# EAGLE design DigitalIn-01b (EAGLE 6.2)
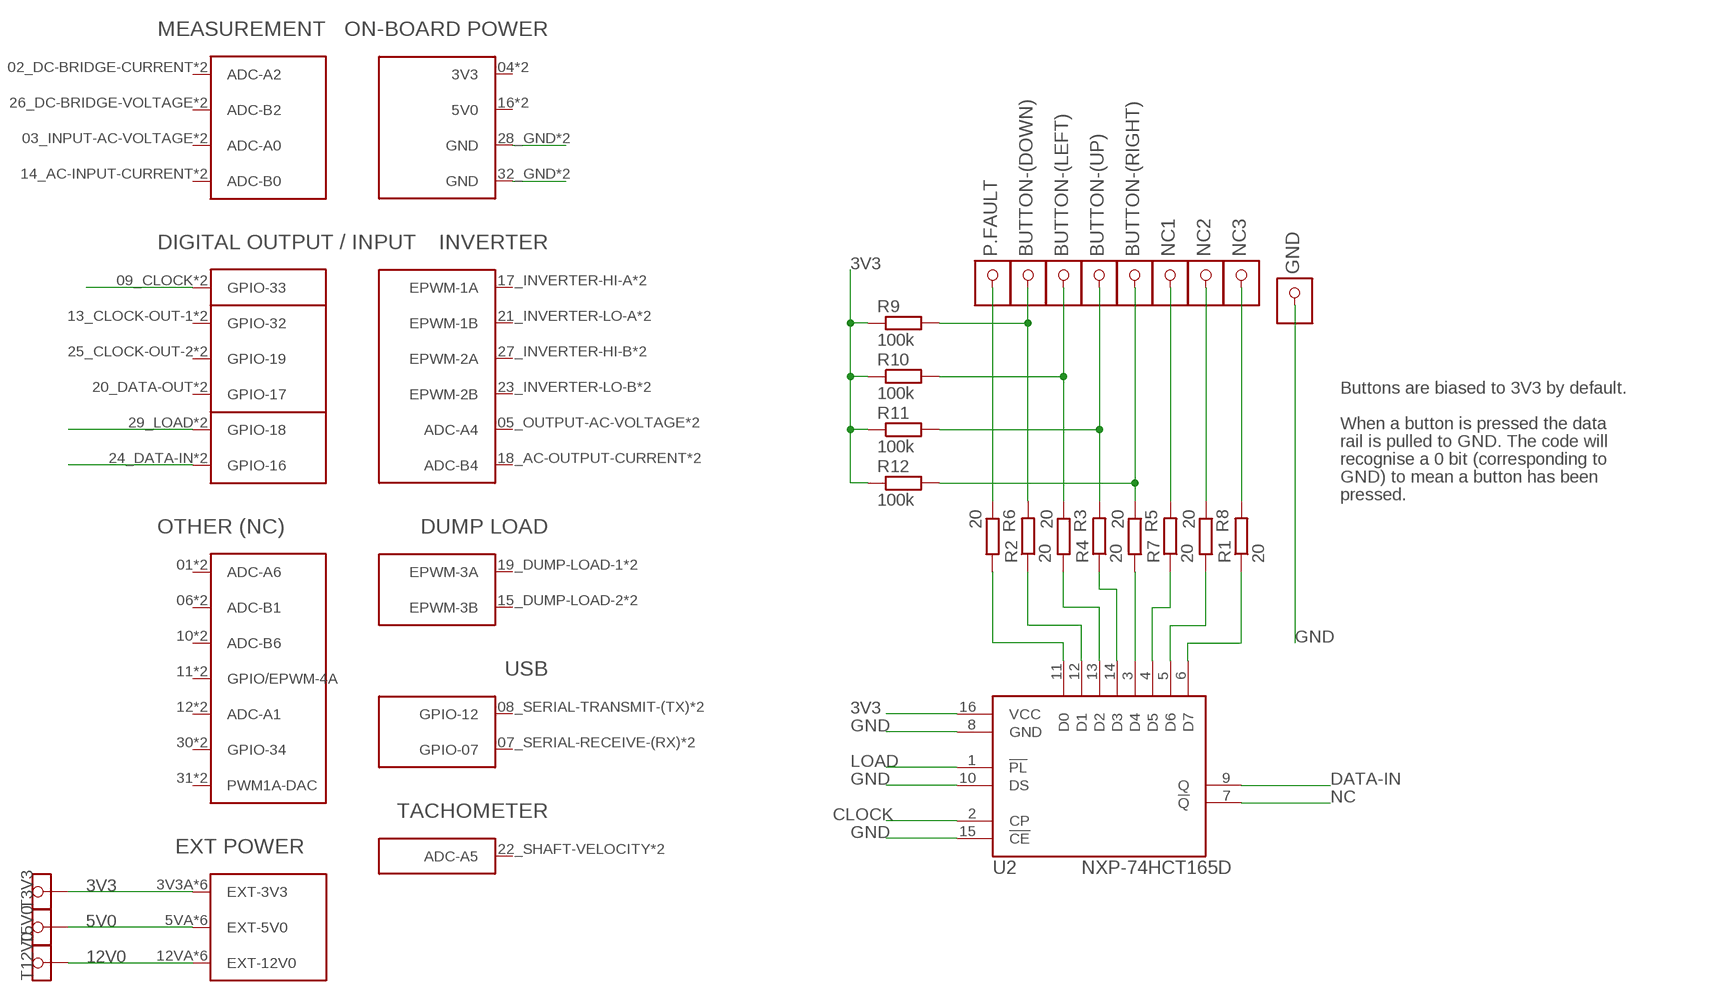
[diagram p0: schematic, sheet 1]

## Parts
BUTTON-(DOWN)  1X1HEADER(W/VIA)  [1X1HEADER(W/VIA)]
BUTTON-(LEFT)  1X1HEADER(W/VIA)  [1X1HEADER(W/VIA)]
BUTTON-(RIGHT)  1X1HEADER(W/VIA)  [1X1HEADER(W/VIA)]
BUTTON-(UP)  1X1HEADER(W/VIA)  [1X1HEADER(W/VIA)]
GND  1X1HEADER(W/VIA)  [1X1HEADER(W/VIA)]
NC1  1X1HEADER(W/VIA)  [1X1HEADER(W/VIA)]
NC2  1X1HEADER(W/VIA)  [1X1HEADER(W/VIA)]
NC3  1X1HEADER(W/VIA)  [1X1HEADER(W/VIA)]
P.FAULT  1X1HEADER(W/VIA)  [1X1HEADER(W/VIA)]
R1  20  R-EU_R0805  [R0805]
R2  20  R-EU_R0805  [R0805]
R3  20  R-EU_R0805  [R0805]
R4  20  R-EU_R0805  [R0805]
R5  20  R-EU_R0805  [R0805]
R6  20  R-EU_R0805  [R0805]
R7  20  R-EU_R0805  [R0805]
R8  20  R-EU_R0805  [R0805]
R9  100k  R-EU_R0805  [R0805]
R10  100k  R-EU_R0805  [R0805]
R11  100k  R-EU_R0805  [R0805]
R12  100k  R-EU_R0805  [R0805]
T3V3  TESTPAD  [TESTPAD]
T5V0  TESTPAD  [TESTPAD]
T12V0  TESTPAD  [TESTPAD]
U1  CONTROLLER_STACK  [CONTROLLER_STACK]
U2  NXP-74HCT165D  [SOIC-16D]

## Nets
3V3: R9.1 R10.1 R11.1 R12.1 T3V3.TP U1.3V3A(EXT-3V3) U1.3V3B(EXT-3V3) U1.3V3C(EXT-3V3) U1.3V3D(EXT-3V3) U1.3V3E(EXT-3V3) U1.3V3F(EXT-3V3) U2.16(VCC)
5V0: T5V0.TP U1.5VA(EXT-5V0) U1.5VB(EXT-5V0) U1.5VC(EXT-5V0) U1.5VD(EXT-5V0) U1.5VE(EXT-5V0) U1.5VF(EXT-5V0)
12V0: T12V0.TP U1.12VA(EXT-12V0) U1.12VB(EXT-12V0) U1.12VC(EXT-12V0) U1.12VD(EXT-12V0) U1.12VE(EXT-12V0) U1.12VF(EXT-12V0)
CLOCK: U1.09_CLOCK(GPIO-33) U1.C9(GPIO-33) U2.2(CP)
DATA-IN: U1.24_DATA-IN(GPIO-16) U1.C24(GPIO-16) U2.9(Q)
GND: GND.P$2 GND.P$3 GND.P$4 GND.PAD U1.28_GND(GND) U1.32_GND(GND) U1.C28(GND) U1.C32(GND) U2.8(GND) U2.10(DS) U2.15(!CE)
LOAD: U1.29_LOAD(GPIO-18) U1.C29(GPIO-18) U2.1(!PL)
N$1: R6.2 U2.11(D0)
N$2: R2.1 U2.12(D1)
N$3: R3.2 U2.13(D2)
N$4: R4.1 U2.14(D3)
N$5: P.FAULT.P$2 P.FAULT.P$3 P.FAULT.P$4 P.FAULT.PAD R6.1
N$6: R7.1 U2.4(D5)
N$7: R8.2 U2.5(D6)
N$8: U2.7(!Q)
N$9: R1.1 U2.6(D7)
N$10: R5.2 U2.3(D4)
N$11: BUTTON-(DOWN).P$2 BUTTON-(DOWN).P$3 BUTTON-(DOWN).P$4 BUTTON-(DOWN).PAD R2.2 R9.2
N$12: BUTTON-(LEFT).P$2 BUTTON-(LEFT).P$3 BUTTON-(LEFT).P$4 BUTTON-(LEFT).PAD R3.1 R10.2
N$13: BUTTON-(UP).P$2 BUTTON-(UP).P$3 BUTTON-(UP).P$4 BUTTON-(UP).PAD R4.2 R11.2
N$14: BUTTON-(RIGHT).P$2 BUTTON-(RIGHT).P$3 BUTTON-(RIGHT).P$4 BUTTON-(RIGHT).PAD R5.1 R12.2
N$15: NC1.P$2 NC1.P$3 NC1.P$4 NC1.PAD R7.2
N$16: NC2.P$2 NC2.P$3 NC2.P$4 NC2.PAD R8.1
N$17: NC3.P$2 NC3.P$3 NC3.P$4 NC3.PAD R1.2
Unconnected: U1.01(ADC-A6) U1.02_DC-BRIDGE-CURRENT(ADC-A2) U1.03_INPUT-AC-VOLTAGE(ADC-A0) U1.04(3V3) U1.05_OUTPUT-AC-VOLTAGE(ADC-A4) U1.06(ADC-B1) U1.07_SERIAL-RECEIVE-(RX)(GPIO-07) U1.08_SERIAL-TRANSMIT-(TX)(GPIO-12) U1.10(ADC-B6) U1.11(GPIO/EPWM-4A) U1.12(ADC-A1) U1.13_CLOCK-OUT-1(GPIO-32) U1.14_AC-INPUT-CURRENT(ADC-B0) U1.15_DUMP-LOAD-2(EPWM-3B) U1.16(5V0) U1.17_INVERTER-HI-A(EPWM-1A) U1.18_AC-OUTPUT-CURRENT(ADC-B4) U1.19_DUMP-LOAD-1(EPWM-3A) U1.20_DATA-OUT(GPIO-17) U1.21_INVERTER-LO-A(EPWM-1B) U1.22_SHAFT-VELOCITY(ADC-A5) U1.23_INVERTER-LO-B(EPWM-2B) U1.25_CLOCK-OUT-2(GPIO-19) U1.26_DC-BRIDGE-VOLTAGE(ADC-B2) U1.27_INVERTER-HI-B(EPWM-2A) U1.30(GPIO-34) U1.31(PWM1A-DAC) U1.C1(ADC-A6) U1.C2(ADC-A2) U1.C3(ADC-A0) U1.C4(3V3) U1.C5(ADC-A4) U1.C6(ADC-B1) U1.C7(GPIO-07) U1.C8(GPIO-12) U1.C10(ADC-B6) U1.C11(GPIO/EPWM-4A) U1.C12(ADC-A1) U1.C13(GPIO-32) U1.C14(ADC-B0) U1.C15(EPWM-3B) U1.C16(5V0) U1.C17(EPWM-1A) U1.C18(ADC-B4) U1.C19(EPWM-3A) U1.C20(GPIO-17) U1.C21(EPWM-1B) U1.C22(ADC-A5) U1.C23(EPWM-2B) U1.C25(GPIO-19) U1.C26(ADC-B2) U1.C27(EPWM-2A) U1.C30(GPIO-34) U1.C31(PWM1A-DAC)

## Notes on the sheet
- Buttons are biased to 3V3 by default.
- When a button is pressed the data
- rail is pulled to GND. The code will
- recognise a 0 bit (corresponding to
- GND) to mean a button has been
- pressed.
- NC

## Library data of the parts
BUTTON-(DOWN) BUTTON-(LEFT) BUTTON-(RIGHT) BUTTON-(UP) GND NC1-NC3 P.FAULT = headers v6-2:1X1HEADER(W/VIA)
R1-R12 = rcl:R-EU_: RESISTOR, European symbol
T3V3 T5V0 T12V0 = PCB_ControlStack:TESTPAD
U1 = PCB_ControlStack:CONTROLLER_STACK
U2 = PCB_ControlStack:NXP-74HCT165D: NXP 74HCT165D Parallel-to-Serial Shift Register, 8 bit, Parallel load or Serial shift

## Board
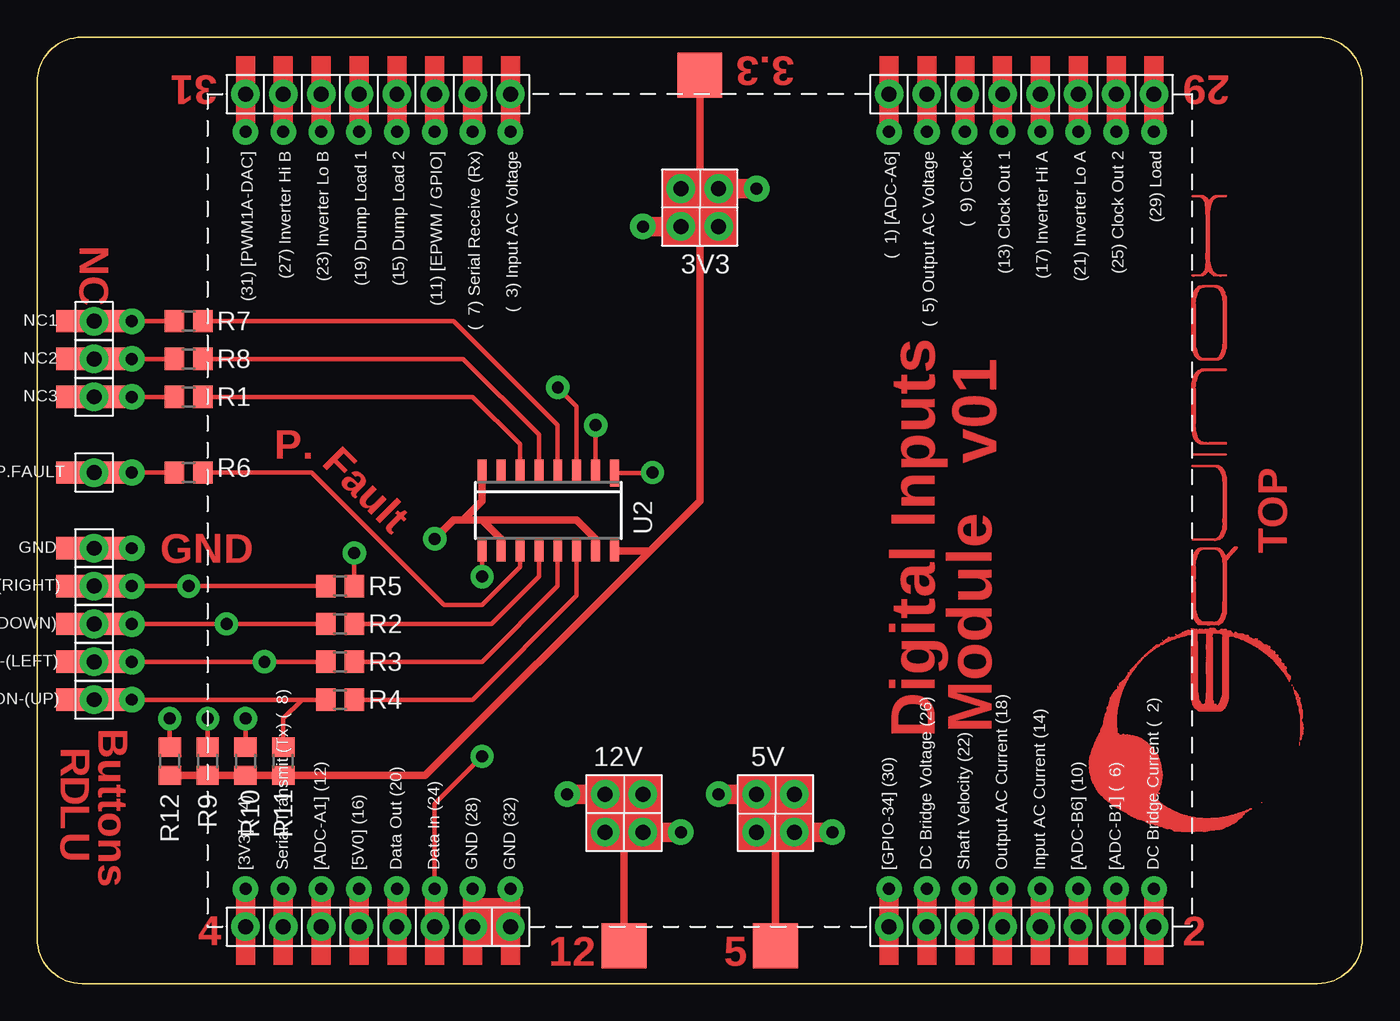
[diagram p1: board, top side]
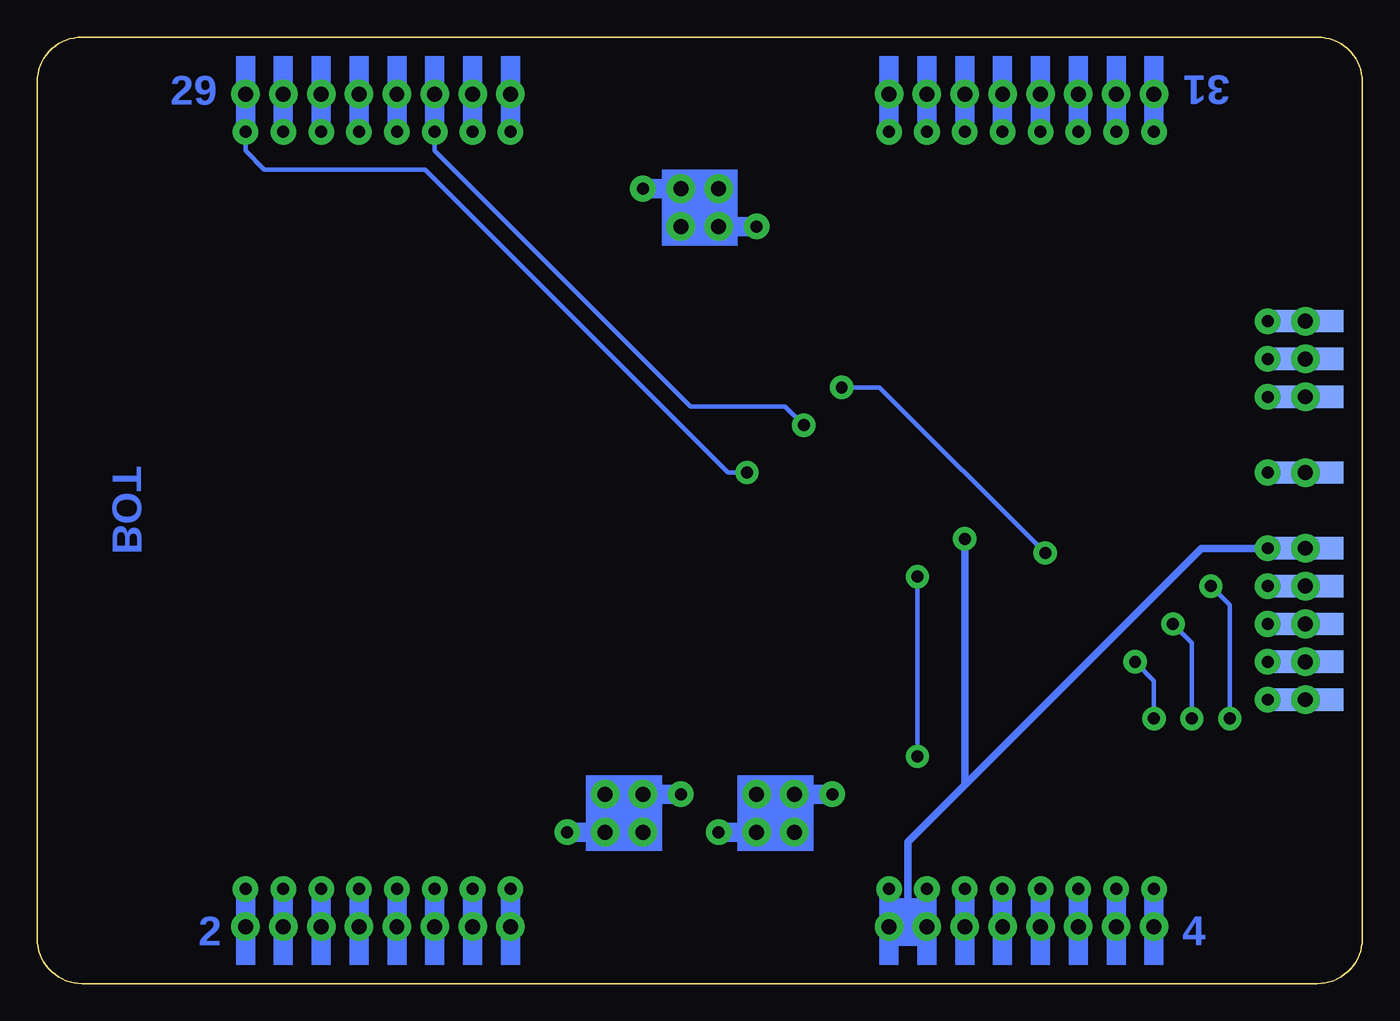
[diagram p2: board, bottom side, seen from below]

Size 88.9 x 63.5 mm. Coordinates in mm from the lower left corner, seen from the top.
Outline: 3,0 85.9,0 arc90 88.9,3 88.9,60.5 arc90 85.9,63.5 3,63.5 arc90 0,60.5 0,3 arc90 3,0
Copper layers (1*16): Top 0.035mm / dielectric 1.5mm / Bottom 0.035mm
Design rules: minimum track width 12mil, minimum drill 0.7mm, track to track 25mil, track to pad 20mil, pad to pad 15mil, via to via 20mil, smd to smd 0mil, copper to edge 30mil, drill to drill 10mil, minimum pad ring 18mil, minimum via ring 15mil, stop-mask expansion 0mil, vias tented up to drill 0mil, thermal gap 15mil
tRestrict: 8 lines
bRestrict: 8 lines

### Footprints (pad centres in the part's own frame; a part is rotated, then mirrored left to right if it is on the bottom)
1X1HEADER(W/VIA) = smd 5.08 x 1.5: P$2 0,0 | smd 5.08 x 1.5 bottom: P$3 0,0 | drill 0.8: P$4 2.54,0 | drill 1: PAD 0,0
R0805 = smd 1.3 x 1.5: 1 -0.95,0; 2 0.95,0
TESTPAD = smd 3 x 3: TP 0,0
CONTROLLER_STACK = drill 1: 01 -27.94,12.7; 02_DC-BRIDGE-CURRENT 27.94,30.48; 03_INPUT-AC-VOLTAGE -27.94,-12.7; 3V3B -21.59,-1.27; 3V3C -21.59,1.27; 3V3E -19.05,1.27; 3V3F -19.05,-1.27; 04 27.94,-30.48; 05_OUTPUT-AC-VOLTAGE -27.94,15.24; 5VB 19.05,3.81; 5VC 19.05,6.35; 5VE 21.59,6.35; 5VF 21.59,3.81; 06 27.94,27.94; 07_SERIAL-RECEIVE-(RX) -27.94,-15.24; 08_SERIAL-TRANSMIT-(TX) 27.94,-27.94; 09_CLOCK -27.94,17.78; 10 27.94,25.4; 11 -27.94,-17.78; 12 27.94,-25.4; 12VB 19.05,-6.35; 12VC 19.05,-3.81; 12VE 21.59,-3.81; 12VF 21.59,-6.35; 13_CLOCK-OUT-1 -27.94,20.32; 14_AC-INPUT-CURRENT 27.94,22.86; 15_DUMP-LOAD-2 -27.94,-20.32; 16 27.94,-22.86; 17_INVERTER-HI-A -27.94,22.86; 18_AC-OUTPUT-CURRENT 27.94,20.32; 19_DUMP-LOAD-1 -27.94,-22.86; 20_DATA-OUT 27.94,-20.32; 21_INVERTER-LO-A -27.94,25.4; 22_SHAFT-VELOCITY 27.94,17.78; 23_INVERTER-LO-B -27.94,-25.4; 24_DATA-IN 27.94,-17.78; 25_CLOCK-OUT-2 -27.94,27.94; 26_DC-BRIDGE-VOLTAGE 27.94,15.24; 27_INVERTER-HI-B -27.94,-27.94; 28_GND 27.94,-15.24; 29_LOAD -27.94,30.48; 30 27.94,12.7; 31 -27.94,-30.48; 32_GND 27.94,-12.7 | drill 0.8: 3V3A -21.59,3.81; 3V3D -19.05,-3.81; 5VA 19.05,1.27; 5VD 21.59,8.89; 12VA 19.05,-8.89; 12VD 21.59,-1.27; C1 -25.4,12.7; C2 25.4,30.48; C3 -25.4,-12.7; C4 25.4,-30.48; C5 -25.4,15.24; C6 25.4,27.94; C7 -25.4,-15.24; C8 25.4,-27.94; C9 -25.4,17.78; C10 25.4,25.4; C11 -25.4,-17.78; C12 25.4,-25.4; C13 -25.4,20.32; C14 25.4,22.86; C15 -25.4,-20.32; C16 25.4,-22.86; C17 -25.4,22.86; C18 25.4,20.32; C19 -25.4,-22.86; C20 25.4,-20.32; C21 -25.4,25.4; C22 25.4,17.78; C23 -25.4,-25.4; C24 25.4,-17.78; C25 -25.4,27.94; C26 25.4,15.24; C27 -25.4,-27.94; C28 25.4,-15.24; C29 -25.4,30.48; C30 25.4,12.7; C31 -25.4,-30.48; C32 25.4,-12.7
SOIC-16D = smd 0.6 x 1.8: 1 -4.445,-2.515 | smd 0.6 x 1.4: 2 -3.175,-2.715; 3 -1.905,-2.715; 4 -0.635,-2.715; 5 0.635,-2.715; 6 1.905,-2.715; 7 3.175,-2.715; 8 4.445,-2.715; 9 4.445,2.715; 10 3.175,2.715; 11 1.905,2.715; 12 0.635,2.715; 13 -0.635,2.715; 14 -1.905,2.715; 15 -3.175,2.715; 16 -4.445,2.715

### Placement (x,y rotation side)
BUTTON-(DOWN)  3.81,24.13 0 top
BUTTON-(LEFT)  3.81,21.59 0 top
BUTTON-(RIGHT)  3.81,26.67 0 top
BUTTON-(UP)  3.81,19.05 0 top
GND  3.81,29.21 0 top
NC1  3.81,44.45 0 top
NC2  3.81,41.91 0 top
NC3  3.81,39.37 0 top
P.FAULT  3.81,34.29 0 top
R1  10.16,39.37 180 top
R2  20.32,24.13 180 top
R3  20.32,21.59 0 top
R4  20.32,19.05 180 top
R5  20.32,26.67 0 top
R6  10.16,34.29 0 top
R7  10.16,44.45 180 top
R8  10.16,41.91 0 top
R9  11.43,14.92 90 top
R10  13.97,14.92 90 top
R11  16.51,14.92 90 top
R12  8.89,14.92 90 top
T3V3  44.45,60.96 0 top
T5V0  49.53,2.54 180 top
T12V0  39.37,2.54 180 top
U1  44.45,31.75 270 top
U2  34.29,31.75 180 top

### Tracks (layer width: path | path; a pad name or v marks a point on that pad's centre or on a via)
3V3
  Top 0.3: U1.3V3D U1.3V3F U1.3V3B 44.45,53.34 U1.3V3C | U1.3V3C U1.3V3E | U1.3V3C U1.3V3A
  Top 0.5: T3V3.TP 44.45,53.34 | R12.1 R9.1 R10.1 R11.1 26.04,13.97 41.1,29.04 | 41.1,29.04 44.45,32.38 44.45,50.8 U1.3V3D | U2.16 41.1,29.04
5V0
  Top 0.5: U1.5VF 49.53,10.16 | 49.53,10.16 U1.5VE | U1.5VE U1.5VC U1.5VB U1.5VA | U1.5VD U1.5VE | T5V0.TP 49.53,10.16
12V0
  Top 0.5: U1.12VA U1.12VB U1.12VC U1.12VE | U1.12VE 39.37,10.16 | 39.37,10.16 U1.12VF | U1.12VE U1.12VD | T12V0.TP 39.37,10.16
CLOCK  (via drill 0.8)
  Top 0.3: U2.2 37.47,36.2 v37.47,37.47
  Top 0.5: U1.09_CLOCK U1.C9
  Bottom 0.3: U1.C9 62.23,55.88 45.09,38.73 38.73,38.73 v37.47,37.47
DATA-IN  (via drill 0.8)
  Top 0.3: U1.C24 26.67,12.06 v29.84,15.24 | v29.84,27.3 U2.9
  Top 0.5: U1.24_DATA-IN U1.C24
  Bottom 0.3: v29.84,15.24 v29.84,27.3
GND  (via drill 0.8)
  Top 0.3: GND.P$2 GND.P$4
  Top 0.5: U1.28_GND U1.C28 | U1.C32 U1.32_GND | 29.84,31.11 36.2,31.11 37.47,29.84 U2.15 | 29.84,31.11 28.57,31.11 | 28.57,31.11 27.94,31.11 v26.67,29.84 | U2.10 31.11,29.84 29.84,31.11 | U2.8 29.84,32.38 28.57,31.11
  Bottom 0.5: GND.P$4 10.79,29.21 26.67,13.34 | 30.48,5.08 30.48,9.53 26.67,13.34 | 30.48,5.08 U1.28_GND | 30.48,5.08 U1.32_GND | v26.67,29.84 26.67,13.34
LOAD  (via drill 0.8)
  Top 0.3: U2.1 40.64,34.27 | 40.64,34.27 41.25,34.27 v41.27,34.29 40.66,34.29 40.64,34.27
  Top 0.5: U1.29_LOAD U1.C29
  Bottom 0.3: U1.C29 74.93,55.88 73.66,54.61 62.87,54.61 42.55,34.29 v41.27,34.29
N$1
  Top 0.3: U2.11 32.38,27.94 29.84,25.4 27.3,25.4 18.41,34.29 R6.2
N$2
  Top 0.3: U2.12 33.66,27.3 30.48,24.13 R2.1
N$3
  Top 0.3: U2.13 34.92,26.67 29.84,21.59 R3.2
N$4
  Top 0.3: U2.14 36.2,26.04 29.21,19.05 R4.1
N$5
  Top 0.3: R6.1 P.FAULT.P$4
  Top 0.5: P.FAULT.P$2 P.FAULT.P$4
N$6
  Top 0.3: R7.1 27.94,44.45 34.92,37.47 U2.4
N$7
  Top 0.3: R8.2 28.57,41.91 33.66,36.83 U2.5
N$9
  Top 0.3: R1.1 29.21,39.37 32.38,36.2 U2.6
N$10  (via drill 0.8)
  Top 0.3: R5.2 21.27,27.94 v21.27,28.89 | U2.3 36.2,38.73 v34.92,40.01
  Bottom 0.3: v34.92,40.01 32.38,40.01 v21.27,28.89
N$11  (via drill 0.8)
  Top 0.3: BUTTON-(DOWN).P$2 BUTTON-(DOWN).P$4 v12.7,24.13 R2.2 | R9.2 v11.43,17.78
  Bottom 0.3: v11.43,17.78 11.43,22.86 v12.7,24.13
N$12  (via drill 0.8)
  Top 0.3: BUTTON-(LEFT).P$2 BUTTON-(LEFT).P$4 v15.24,21.59 R3.1 | R10.2 v13.97,17.78
  Bottom 0.3: v13.97,17.78 13.97,20.32 v15.24,21.59
N$13
  Top 0.3: BUTTON-(UP).P$2 BUTTON-(UP).P$4 17.78,19.05 | 17.78,19.05 R4.2 | R11.2 16.51,17.78 17.78,19.05
N$14  (via drill 0.8)
  Top 0.3: BUTTON-(RIGHT).P$2 BUTTON-(RIGHT).P$4 v10.16,26.67 R5.1 | R12.2 v8.89,17.78
  Bottom 0.3: v8.89,17.78 8.89,25.4 v10.16,26.67
N$15
  Top 0.3: NC1.P$4 R7.2
  Top 0.5: NC1.P$2 NC1.P$4
N$16
  Top 0.3: R8.1 NC2.P$4
  Top 0.5: NC2.P$2 NC2.P$4
N$17
  Top 0.3: NC3.P$4 R1.2
  Top 0.5: NC3.P$2 NC3.P$4
(copper drawn outside any net)
  shapes: Bottom area x1, Top area x2019

### Text on the board
Top: 3.3 | NC | v01 | P. | Fault | TOP | GND | Buttons | Digital Inputs | Module | R | D | L | U | 12 | 5
Bottom: BOT